# Altium schematic sheet SCH-00001-AA-01.SchDoc
size A4; SheetNumber: 2; SheetTotal: 4
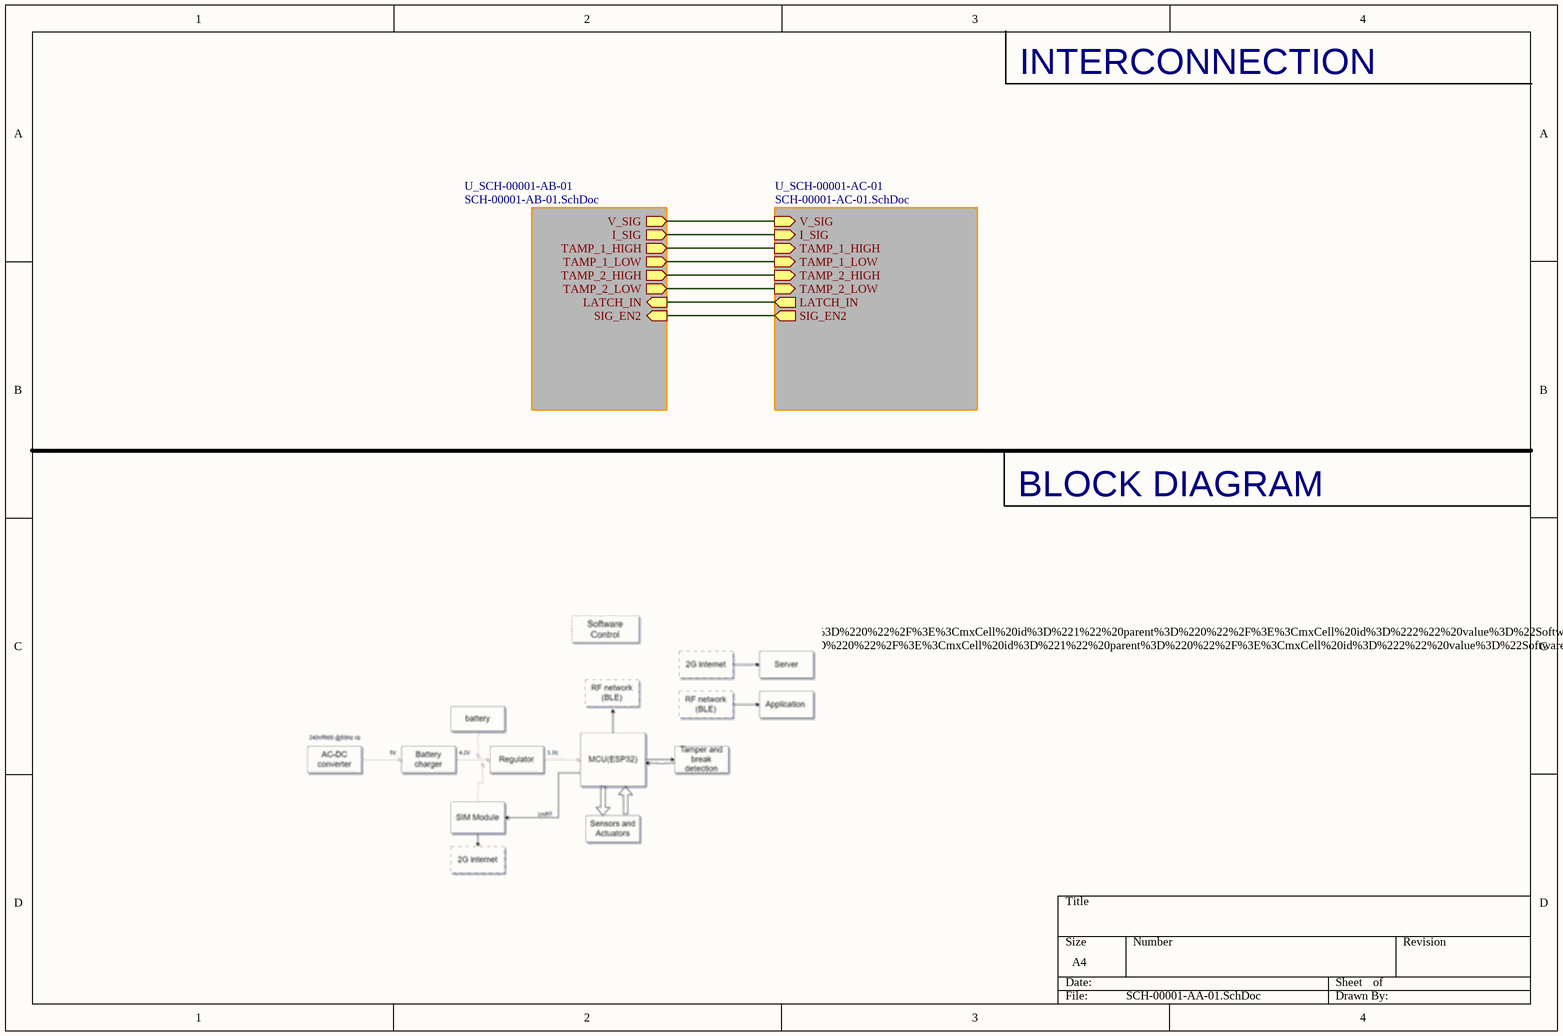
[diagram p0: SCH-00001-AA-01.SchDoc]

## Sub-sheets
U_SCH-00001-AB-01 = SCH-00001-AB-01.SchDoc: SIG_EN2 (in), V_SIG (out), I_SIG (out), LATCH_IN (in), TAMP_1_HIGH (out), TAMP_1_LOW (out), TAMP_2_HIGH (out), TAMP_2_LOW (out)
U_SCH-00001-AC-01 = SCH-00001-AC-01.SchDoc: SIG_EN2 (out), V_SIG (in), I_SIG (in), LATCH_IN (out), TAMP_1_HIGH (in), TAMP_1_LOW (in), TAMP_2_HIGH (in), TAMP_2_LOW (in)

## Nets
(unnamed): sheet U_SCH-00001-AB-01/SIG_EN2, sheet U_SCH-00001-AC-01/SIG_EN2
(unnamed): sheet U_SCH-00001-AB-01/V_SIG, sheet U_SCH-00001-AC-01/V_SIG
(unnamed): sheet U_SCH-00001-AB-01/I_SIG, sheet U_SCH-00001-AC-01/I_SIG
(unnamed): sheet U_SCH-00001-AB-01/LATCH_IN, sheet U_SCH-00001-AC-01/LATCH_IN
(unnamed): sheet U_SCH-00001-AB-01/TAMP_1_HIGH, sheet U_SCH-00001-AC-01/TAMP_1_HIGH
(unnamed): sheet U_SCH-00001-AB-01/TAMP_1_LOW, sheet U_SCH-00001-AC-01/TAMP_1_LOW
(unnamed): sheet U_SCH-00001-AB-01/TAMP_2_HIGH, sheet U_SCH-00001-AC-01/TAMP_2_HIGH
(unnamed): sheet U_SCH-00001-AB-01/TAMP_2_LOW, sheet U_SCH-00001-AC-01/TAMP_2_LOW

## Notes on the sheet
- INTERCONNECTION
- BLOCK DIAGRAM
- %3CmxGraphModel%3E%3Croot%3E%3CmxCell%20id%3D%220%22%2F%3E%3CmxCell%20id%3D%221%22%20parent%3D%220%22%2F%3E%3CmxCell%20id%3D%222%22%20value%3D%22Software%20Control%22%20style%3D%22whiteSpace%3Dwrap%3Bhtml%3D1%3Bshadow%3D1%3BfontSize%3D20%3BfillColor%3D%23f5f5f5%3BstrokeColor%3D%23666666%3BstrokeWidth%3D2%3Bdashed%3D1%3B%22%20vertex%3D%221%22%20parent%3D%221%22%3E%3CmxGeometry%20x%3D%22797%22%20y%3D%22344%22%20width%3D%22150%22%20height%3D%2260%22%20as%3D%22geometry%22%2F%3E%3C%2FmxCell%3E%3CmxCell%20id%3D%223%22%20style%3D%22edgeStyle%3DelbowEdgeStyle%3Brounded%3D0%3Bhtml%3D1%3BstartArrow%3Dnone%3BstartFill%3D0%3BjettySize%3Dauto%3BorthogonalLoop%3D1%3BfontSize%3D18%3Belbow%3Dvertical%3B%22%20edge%3D%221%22%20source%3D%228%22%20target%3D%229%22%20parent%3D%221%22%3E%3CmxGeometry%20relative%3D%221%22%20as%3D%22geometry%22%2F%3E%3C%2FmxCell%3E%3CmxCell%20id%3D%224%22%20style%3D%22edgeStyle%3DelbowEdgeStyle%3Brounded%3D0%3Bhtml%3D1%3BstartArrow%3Dnone%3BstartFill%3D0%3BjettySize%3Dauto%3BorthogonalLoop%3D1%3BfontSize%3D18%3Belbow%3Dvertical%3B%22%20edge%3D%221%22%20source%3D%228%22%20target%3D%2210%22%20parent%3D%221%22%3E%3CmxGeometry%20relative%3D%221%22%20as%3D%22geometry%22%2F%3E%3C%2FmxCell%3E%3CmxCell%20id%3D%225%22%20style%3D%22edgeStyle%3DelbowEdgeStyle%3Brounded%3D0%3Bhtml%3D1%3BstartArrow%3Dnone%3BstartFill%3D0%3BjettySize%3Dauto%3BorthogonalLoop%3D1%3BfontSize%3D18%3Belbow%3Dvertical%3B%22%20edge%3D%221%22%20source%3D%228%22%20target%3D%2211%22%20parent%3D%221%22%3E%3CmxGeometry%20relative%3D%221%22%20as%3D%22geometry%22%2F%3E%3C%2FmxCell%3E%3CmxCell%20id%3D%226%22%20style%3D%22edgeStyle%3DelbowEdgeStyle%3Brounded%3D0%3Bhtml%3D1%3BstartArrow%3Dnone%3BstartFill%3D0%3BjettySize%3Dauto%3BorthogonalLoop%3D1%3BfontSize%3D18%3Belbow%3Dvertical%3B%22%20edge%3D%221%22%20source%3D%228%22%20target%3D%2212%22%20parent%3D%221%22%3E%3CmxGeometry%20relative%3D%221%22%20as%3D%22geometry%22%2F%3E%3C%2FmxCell%3E%3CmxCell%20id%3D%227%22%20style%3D%22edgeStyle%3DelbowEdgeStyle%3Brounded%3D0%3Bhtml%3D1%3BstartArrow%3Dnone%3BstartFill%3D0%3BjettySize%3Dauto%3BorthogonalLoop%3D1%3BfontSize%3D18%3B%22%20edge%3D%221%22%20source%3D%2217%22%20target%3D%228%22%20parent%3D%221%22%3E%3CmxGeometry%20relative%3D%221%22%20as%3D%22geometry%22%3E%3CArray%20as%3D%22points%22%3E%3CmxPoint%20x%3D%22907%22%20y%3D%22754%22%2F%3E%3C%2FArray%3E%3C%2FmxGeometry%3E%3C%2FmxCell%3E%3CmxCell%20id%3D%228%22%20value%3D%22Custom%20switch%20Matrix%26lt%3Bdiv%26gt%3B%26lt%3Bbr%26gt%3B%26lt%3B%2Fdiv%26gt%3B%26lt%3Bdiv%26gt%3B(switches%2C%20couplers%2C%20mixer%2C%20amps%2C%20attenu%2C%20splitters)%26lt%3B%2Fdiv%26gt%3B%22%20style%3D%22whiteSpace%3Dwrap%3Bhtml%3D1%3Bshadow%3D1%3BfontSize%3D18%3BfillColor%3D%23f5f5f5%3BstrokeColor%3D%23666666%3B%22%20vertex%3D%221%22%20parent%3D%221%22%3E%3CmxGeometry%20x%3D%22787%22%20y%3D%22454%22%20width%3D%22170%22%20height%3D%22280%22%20as%3D%22geometry%22%2F%3E%3C%2FmxCell%3E%3CmxCell%20id%3D%229%22%20value%3D%22Spectrum%20Analyzer%22%20style%3D%22whiteSpace%3Dwrap%3Bhtml%3D1%3Bshadow%3D1%3BfontSize%3D18%3BfillColor%3D%23f5f5f5%3BstrokeColor%3D%23666666%3B%22%20vertex%3D%221%22%20parent%3D%221%22%3E%3CmxGeometry%20x%3D%221037%22%20y%3D%22444%22%20width%3D%22120%22%20height%3D%2260%22%20as%3D%22geometry%22%2F%3E%3C%2FmxCell%3E%3CmxCell%20id%3D%2210%22%20value%3D%22Network%20Analyzer%22%20style%3D%22whiteSpace%3Dwrap%3Bhtml%3D1%3Bshadow%3D1%3BfontSize%3D18%3BfillColor%3D%23f5f5f5%3BstrokeColor%3D%23666666%3B%22%20vertex%3D%221%22%20parent%3D%221%22%3E%3CmxGeometry%20x%3D%221037%22%20y%3D%22524%22%20width%3D%22120%22%20height%3D%2260%22%20as%3D%22geometry%22%2F%3E%3C%2FmxCell%3E%3CmxCell%20id%3D%2211%22%20value%3D%22Power%20Meter%22%20style%3D%22whiteSpace%3Dwrap%3Bhtml%3D1%3Bshadow%3D1%3BfontSize%3D18%3BfillColor%3D%23f5f5f5%3BstrokeColor%3D%23666666%3B%22%20vertex%3D%221%22%20parent%3D%221%22%3E%3CmxGeometry%20x%3D%221037%22%20y%3D%22604%22%20width%3D%22120%22%20height%3D%2260%22%20as%3D%22geometry%22%2F%3E%3C%2FmxCell%3E%3CmxCell%20id%3D%2212%22%20value%3D%22Freq.%20Count%22%20style%3D%22whiteSpace%3Dwrap%3Bhtml%3D1%3Bshadow%3D1%3BfontSize%3D18%3BfillColor%3D%23f5f5f5%3BstrokeColor%3D%23666666%3B%22%20vertex%3D%221%22%20parent%3D%221%22%3E%3CmxGeometry%20x%3D%221037%22%20y%3D%22684%22%20width%3D%22120%22%20height%3D%2260%22%20as%3D%22geometry%22%2F%3E%3C%2FmxCell%3E%3CmxCell%20id%3D%2213%22%20style%3D%22edgeStyle%3DelbowEdgeStyle%3Brounded%3D0%3Bhtml%3D1%3BstartArrow%3Dnone%3BstartFill%3D0%3BjettySize%3Dauto%3BorthogonalLoop%3D1%3BfontSize%3D18%3Belbow%3Dvertical%3B%22%20edge%3D%221%22%20source%3D%2214%22%20target%3D%228%22%20parent%3D%221%22%3E%3CmxGeometry%20relative%3D%221%22%20as%3D%22geometry%22%3E%3CArray%20as%3D%22points%22%3E%3CmxPoint%20x%3D%22757%22%20y%3D%22514%22%2F%3E%3C%2FArray%3E%3C%2FmxGeometry%3E%3C%2FmxCell%3E%3CmxCell%20id%3D%2214%22%20value%3D%22Vector%20Signal%20Generator%22%20style%3D%22whiteSpace%3Dwrap%3Bhtml%3D1%3Bshadow%3D1%3BfontSize%3D18%3BfillColor%3D%23f5f5f5%3BstrokeColor%3D%23666666%3B%22%20vertex%3D%221%22%20parent%3D%221%22%3E%3CmxGeometry%20x%3D%22597%22%20y%3D%22444%22%20width%3D%22120%22%20height%3D%22150%22%20as%3D%22geometry%22%2F%3E%3C%2FmxCell%3E%3CmxCell%20id%3D%2215%22%20style%3D%22edgeStyle%3DelbowEdgeStyle%3Brounded%3D0%3Bhtml%3D1%3BstartArrow%3Dnone%3BstartFill%3D0%3BjettySize%3Dauto%3BorthogonalLoop%3D1%3BfontSize%3D18%3Belbow%3Dvertical%3B%22%20edge%3D%221%22%20source%3D%2216%22%20target%3D%228%22%20parent%3D%221%22%3E%3CmxGeometry%20relative%3D%221%22%20as%3D%22geometry%22%2F%3E%3C%2FmxCell%3E%3CmxCell%20id%3D%2216%22%20value%3D%22ARB%20%2F%20Mod%20Source%22%20style%3D%22whiteSpace%3Dwrap%3Bhtml%3D1%3Bshadow%3D1%3BfontSize%3D18%3BfillColor%3D%23f5f5f5%3BstrokeColor%3D%23666666%3B%22%20vertex%3D%221%22%20parent%3D%221%22%3E%3CmxGeometry%20x%3D%22597%22%20y%3D%22634%22%20width%3D%22120%22%20height%3D%2260%22%20as%3D%22geometry%22%2F%3E%3C%2FmxCell%3E%3CmxCell%20id%3D%2217%22%20value%3D%22Regulator%22%20style%3D%22whiteSpace%3Dwrap%3Bhtml%3D1%3Bshadow%3D1%3BfontSize%3D18%3BfillColor%3D%23f5f5f5%3BstrokeColor%3D%23666666%3B%22%20vertex%3D%221%22%20parent%3D%221%22%3E%3CmxGeometry%20x%3D%22799.5%22%20y%3D%22774%22%20width%3D%22145%22%20height%3D%22120%22%20as%3D%22geometry%22%2F%3E%3C%2FmxCell%3E%3CmxCell%20id%3D%2218%22%20style%3D%22edgeStyle%3DelbowEdgeStyle%3Brounded%3D0%3Bhtml%3D1%3BstartArrow%3Dnone%3BstartFill%3D0%3BjettySize%3Dauto%3BorthogonalLoop%3D1%3BfontSize%3D18%3Belbow%3Dvertical%3B%22%20edge%3D%221%22%20source%3D%2219%22%20target%3D%2217%22%20parent%3D%221%22%3E%3CmxGeometry%20relative%3D%221%22%20as%3D%22geometry%22%2F%3E%3C%2FmxCell%3E%3CmxCell%20id%3D%2219%22%20value%3D%22Regulator%22%20style%3D%22whiteSpace%3Dwrap%3Bhtml%3D1%3Bshadow%3D1%3BfontSize%3D18%3BfillColor%3D%23f5f5f5%3BstrokeColor%3D%23666666%3B%22%20vertex%3D%221%22%20parent%3D%221%22%3E%3CmxGeometry%20x%3D%22597%22%20y%3D%22804%22%20width%3D%22120%22%20height%3D%2260%22%20as%3D%22geometry%22%2F%3E%3C%2FmxCell%3E%3CmxCell%20id%3D%2220%22%20style%3D%22edgeStyle%3DelbowEdgeStyle%3Brounded%3D0%3Bhtml%3D1%3BstartArrow%3Dnone%3BstartFill%3D0%3BjettySize%3Dauto%3BorthogonalLoop%3D1%3BfontSize%3D18%3B%22%20edge%3D%221%22%20source%3D%2217%22%20target%3D%228%22%20parent%3D%221%22%3E%3CmxGeometry%20relative%3D%221%22%20as%3D%22geometry%22%3E%3CmxPoint%20x%3D%22937%22%20y%3D%22784%22%20as%3D%22sourcePoint%22%2F%3E%3CmxPoint%20x%3D%22937%22%20y%3D%22744%22%20as%3D%22targetPoint%22%2F%3E%3CArray%20as%3D%22points%22%3E%3CmxPoint%20x%3D%22927%22%20y%3D%22754%22%2F%3E%3CmxPoint%20x%3D%22907%22%20y%3D%22754%22%2F%3E%3C%2FArray%3E%3C%2FmxGeometry%3E%3C%2FmxCell%3E%3CmxCell%20id%3D%2221%22%20style%3D%22edgeStyle%3DelbowEdgeStyle%3Brounded%3D0%3Bhtml%3D1%3BstartArrow%3Dnone%3BstartFill%3D0%3BjettySize%3Dauto%3BorthogonalLoop%3D1%3BfontSize%3D18%3B%22%20edge%3D%221%22%20parent%3D%221%22%3E%3CmxGeometry%20relative%3D%221%22%20as%3D%22geometry%22%3E%3CmxPoint%20x%3D%22887%22%20y%3D%22774%22%20as%3D%22sourcePoint%22%2F%3E%3CmxPoint%20x%3D%22887%22%20y%3D%22734%22%20as%3D%22targetPoint%22%2F%3E%3CArray%20as%3D%22points%22%3E%3CmxPoint%20x%3D%22887%22%20y%3D%22754%22%2F%3E%3CmxPoint%20x%3D%22887%22%20y%3D%22754%22%2F%3E%3C%2FArray%3E%3C%2FmxGeometry%3E%3C%2FmxCell%3E%3CmxCell%20id%3D%2222%22%20style%3D%22edgeStyle%3DelbowEdgeStyle%3Brounded%3D0%3Bhtml%3D1%3BstartArrow%3Dnone%3BstartFill%3D0%3BjettySize%3Dauto%3BorthogonalLoop%3D1%3BfontSize%3D18%3B%22%20edge%3D%221%22%20parent%3D%221%22%3E%3CmxGeometry%20relative%3D%221%22%20as%3D%22geometry%22%3E%3CmxPoint%20x%3D%22857%22%20y%3D%22734%22%20as%3D%22sourcePoint%22%2F%3E%3CmxPoint%20x%3D%22857%22%20y%3D%22774%22%20as%3D%22targetPoint%22%2F%3E%3CArray%20as%3D%22points%22%3E%3CmxPoint%20x%3D%22857%22%20y%3D%22754%22%2F%3E%3CmxPoint%20x%3D%22887%22%20y%3D%22764%22%2F%3E%3C%2FArray%3E%3C%2FmxGeometry%3E%3C%2FmxCell%3E%3CmxCell%20id%3D%2223%22%20style%3D%22edgeStyle%3DelbowEdgeStyle%3Brounded%3D0%3Bhtml%3D1%3BstartArrow%3Dnone%3BstartFill%3D0%3BjettySize%3Dauto%3BorthogonalLoop%3D1%3BfontSize%3D18%3B%22%20edge%3D%221%22%20parent%3D%221%22%3E%3CmxGeometry%20relative%3D%221%22%20as%3D%22geometry%22%3E%3CmxPoint%20x%3D%22837%22%20y%3D%22734%22%20as%3D%22sourcePoint%22%2F%3E%3CmxPoint%20x%3D%22837%22%20y%3D%22774%22%20as%3D%22targetPoint%22%2F%3E%3CArray%20as%3D%22points%22%3E%3CmxPoint%20x%3D%22837%22%20y%3D%22754%22%2F%3E%3CmxPoint%20x%3D%22867%22%20y%3D%22764%22%2F%3E%3C%2FArray%3E%3C%2FmxGeometry%3E%3C%2FmxCell%3E%3CmxCell%20id%3D%2224%22%20style%3D%22edgeStyle%3DelbowEdgeStyle%3Brounded%3D0%3Bhtml%3D1%3BstartArrow%3Dnone%3BstartFill%3D0%3BjettySize%3Dauto%3BorthogonalLoop%3D1%3BfontSize%3D18%3B%22%20edge%3D%221%22%20parent%3D%221%22%3E%3CmxGeometry%20relative%3D%221%22%20as%3D%22geometry%22%3E%3CmxPoint%20x%3D%22817%22%20y%3D%22734%22%20as%3D%22sourcePoint%22%2F%3E%3CmxPoint%20x%3D%22817%22%20y%3D%22774%22%20as%3D%22targetPoint%22%2F%3E%3CArray%20as%3D%22points%22%3E%3CmxPoint%20x%3D%22817%22%20y%3D%22754%22%2F%3E%3CmxPoint%20x%3D%22847%22%20y%3D%22764%22%2F%3E%3C%2FArray%3E%3C%2FmxGeometry%3E%3C%2FmxCell%3E%3CmxCell%20id%3D%2225%22%20style%3D%22edgeStyle%3DorthogonalEdgeStyle%3Brounded%3D0%3BorthogonalLoop%3D1%3BjettySize%3Dauto%3Bhtml%3D1%3BexitX%3D1%3BexitY%3D0.5%3BexitDx%3D0%3BexitDy%3D0%3BentryX%3D0%3BentryY%3D0.5%3BentryDx%3D0%3BentryDy%3D0%3B%22%20edge%3D%221%22%20source%3D%2226%22%20target%3D%2219%22%20parent%3D%221%22%3E%3CmxGeometry%20relative%3D%221%22%20as%3D%22geometry%22%2F%3E%3C%2FmxCell%3E%3CmxCell%20id%3D%2226%22%20value%3D%22Battery%20charger%22%20style%3D%22whiteSpace%3Dwrap%3Bhtml%3D1%3Bshadow%3D1%3BfontSize%3D18%3BfillColor%3D%23f5f5f5%3BstrokeColor%3D%23666666%3B%22%20vertex%3D%221%22%20parent%3D%221%22%3E%3CmxGeometry%20x%3D%22420%22%20y%3D%22804%22%20width%3D%22120%22%20height%3D%2260%22%20as%3D%22geometry%22%2F%3E%3C%2FmxCell%3E%3CmxCell%20id%3D%2227%22%20style%3D%22edgeStyle%3DorthogonalEdgeStyle%3Brounded%3D0%3BorthogonalLoop%3D1%3BjettySize%3Dauto%3Bhtml%3D1%3BexitX%3D0.5%3BexitY%3D1%3BexitDx%3D0%3BexitDy%3D0%3B%22%20edge%3D%221%22%20source%3D%2228%22%20parent%3D%221%22%3E%3CmxGeometry%20relative%3D%221%22%20as%3D%22geometry%22%3E%3CmxPoint%20x%3D%22569.608695652174%22%20y%3D%22830%22%20as%3D%22targetPoint%22%2F%3E%3C%2FmxGeometry%3E%3C%2FmxCell%3E%3CmxCell%20id%3D%2228%22%20value%3D%22battery%22%20style%3D%22whiteSpace%3Dwrap%3Bhtml%3D1%3Bshadow%3D1%3BfontSize%3D18%3BfillColor%3D%23f5f5f5%3BstrokeColor%3D%23666666%3B%22%20vertex%3D%221%22%20parent%3D%221%22%3E%3CmxGeometry%20x%3D%22510%22%20y%3D%22714%22%20width%3D%22120%22%20height%3D%2256%22%20as%3D%22geometry%22%2F%3E%3C%2FmxCell%3E%3CmxCell%20id%3D%2229%22%20value%3D%22AC-DC%20converter%22%20style%3D%22whiteSpace%3Dwrap%3Bhtml%3D1%3Bshadow%3D1%3BfontSize%3D18%3BfillColor%3D%23f5f5f5%3BstrokeColor%3D%23666666%3B%22%20vertex%3D%221%22%20parent%3D%221%22%3E%3CmxGeometry%20x%3D%22260%22%20y%3D%22804%22%20width%3D%22120%22%20height%3D%2260%22%20as%3D%22geometry%22%2F%3E%3C%2FmxCell%3E%3C%2Froot%3E%3C%2FmxGraphModel%3E